# Altium schematic sheet ecg_ckt.SchDoc
size A4; SheetNumber: 2; SheetTotal: 5
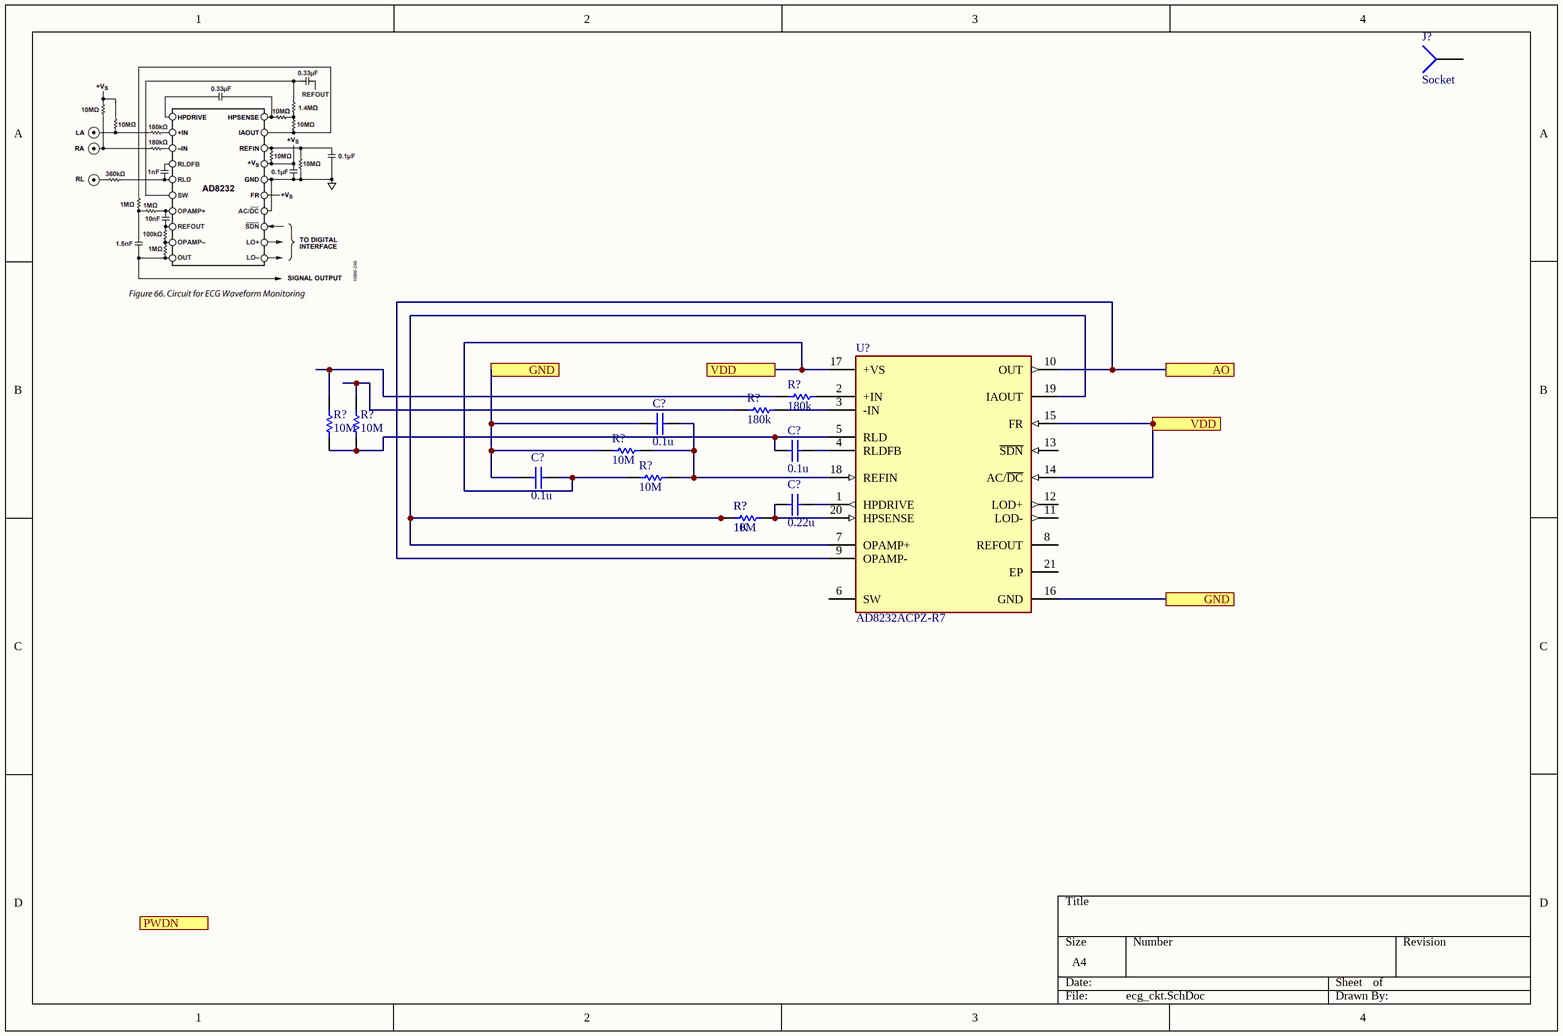
[diagram p0: ecg_ckt.SchDoc]

## Parts
(Parts that share a designator on the sheet are numbered #1, #2 ... from top to bottom, then left to right.)
C?#1  value 0.1u  (hidden comment: Capacitor)
C?#2  value 0.1u  (hidden comment: Capacitor)
C?#3  value 0.1u  (hidden comment: Capacitor)
C?#4  value 0.22u  (hidden comment: Capacitor)
J?  Socket  [PIN1]
R?#1  value 10M  (hidden comment: Resistor)
R?#2  value 10M  (hidden comment: Resistor)
R?#3  value 180k  (hidden comment: Resistor)
R?#4  value 180k  (hidden comment: Resistor)
R?#5  value 10M  (hidden comment: Resistor)
R?#6  value 10M  (hidden comment: Resistor)
R?#7  value 1K  (hidden comment: Resistor)
R?#8  value 10M  (hidden comment: Resistor)
U?  AD8232ACPZ-R7  [FP-CP-20-8-IPC_C]

## Ports
AO, GND, PWDN, VDD

## Nets
AO: U?.9(OPAMP-) U?.10(OUT) ; port AO
GND: C?#1.1 C?#3.1 R?#5.1 U?.16(GND) ; port GND
VDD: C?#3.2 R?#6.1 U?.14(AC/~{DC}) U?.15(FR) U?.17(+VS) ; port VDD
NetC?#1_2: C?#1.2 R?#5.2 R?#6.2 U?.18(REFIN)
NetC?#2_1: C?#2.1 U?.4(RLDFB)
NetC?#2_2: C?#2.2 R?#1.2 R?#2.2 U?.5(RLD)
NetC?#4_1: C?#4.1 U?.1(HPDRIVE)
NetC?#4_2: C?#4.2 R?#7.2 R?#8.2 U?.20(HPSENSE)
NetR?#1_1: R?#1.1 R?#3.1
NetR?#2_1: R?#2.1 R?#4.1
NetR?#3_2: R?#3.2 U?.2(+IN)
NetR?#4_2: R?#4.2 U?.3(-IN)
NetR?#7_1: R?#7.1 R?#8.1 U?.7(OPAMP+) U?.19(IAOUT)

Not connected (* = marked no-connect by the designer): J? 1; U? 6(SW) 8(REFOUT) 11(LOD-) 12(LOD+) 13(~{SDN}) 21(EP)

## Library data of the parts
C?#1-C?#4 = Capacitor: SimulationGenericComponent: True
R?#1-R?#8 = Resistor: TC1: 0; SimulationGenericComponent: True; TC2: 0
U? = CMP-09085-000003-1: IC ECG FRONT END 20LFCSP; Input Offset Voltage (Vos): 3mV; Power Supply Rejection Ratio (PSRR): 90dB; Input Bias Current: 50pA; Nominal Supply Current: 170uA; Min Supply Voltage: 2V; Common Mode Rejection Ratio: 80dB; Max Supply Voltage: 3.5V; Contact Plating: Tin; Operating Supply Current: 170uA; Packaging: Tape and Reel; REACH SVHC: No SVHC; Case/Package: LFCSP EP; Number of Pins: 20; Lead Free: Contains Lead; Min Operating Temperature: -40°C; Package Quantity: 1500; Mount: Surface Mount; Max Operating Temperature: 85°C
J? = Socket: LatestRevisionDate: 17-Jul-2002; LatestRevisionNote: Re-released for DXP Platform.; Publisher: Altium Limited